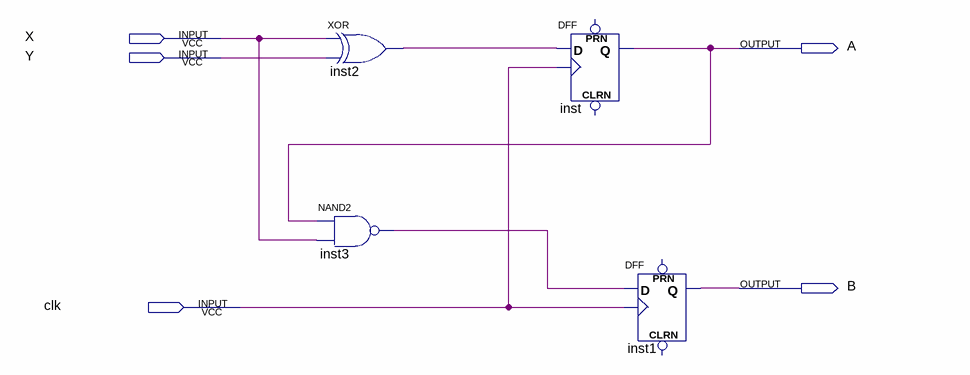
[diagram p0: schematic sheet]
// Quartus schematic vtr.bdf as structural Verilog: 4 symbols, 5 pins
module vtr (
  input  X,
  input  Y,
  input  clk,
  output A,
  output B
);

  wire inst2_out, inst3_out;

  xor inst2 (inst2_out, X, Y);
  nand inst3 (inst3_out, A, X);
  DFF inst (.CLK(clk), .D(inst2_out), .Q(A));  // open: CLRN, PRN
  DFF inst1 (.CLK(clk), .D(inst3_out), .Q(B));  // open: CLRN, PRN
endmodule
